# Altium schematic sheet SwitchMatrix.SchDoc
size A4
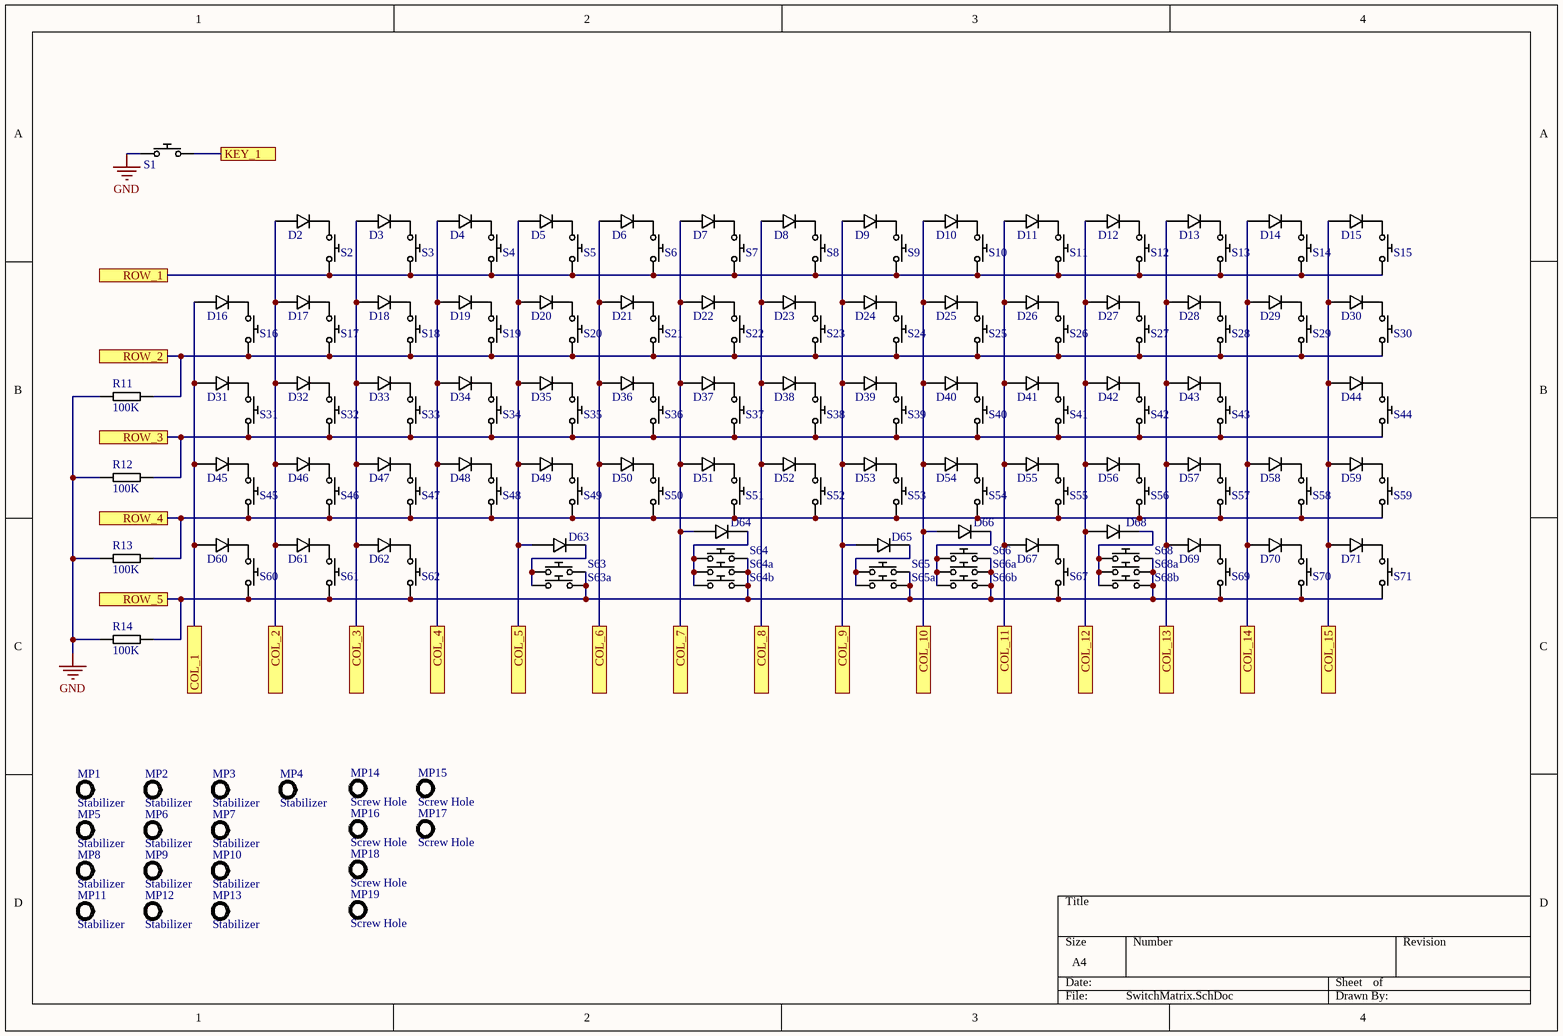
[diagram p0: SwitchMatrix.SchDoc]

## Parts
D2  Diode  [SOD_323]  (value not drawn)
D3  Diode  [SOD_323]  (value not drawn)
D4  Diode  [SOD_323]  (value not drawn)
D5  Diode  [SOD_323]  (value not drawn)
D6  Diode  [SOD_323]  (value not drawn)
D7  Diode  [SOD_323]  (value not drawn)
D8  Diode  [SOD_323]  (value not drawn)
D9  Diode  [SOD_323]  (value not drawn)
D10  Diode  [SOD_323]  (value not drawn)
D11  Diode  [SOD_323]  (value not drawn)
D12  Diode  [SOD_323]  (value not drawn)
D13  Diode  [SOD_323]  (value not drawn)
D14  Diode  [SOD_323]  (value not drawn)
D15  Diode  [SOD_323]  (value not drawn)
D16  Diode  [SOD_323]  (value not drawn)
D17  Diode  [SOD_323]  (value not drawn)
D18  Diode  [SOD_323]  (value not drawn)
D19  Diode  [SOD_323]  (value not drawn)
D20  Diode  [SOD_323]  (value not drawn)
D21  Diode  [SOD_323]  (value not drawn)
D22  Diode  [SOD_323]  (value not drawn)
D23  Diode  [SOD_323]  (value not drawn)
D24  Diode  [SOD_323]  (value not drawn)
D25  Diode  [SOD_323]  (value not drawn)
D26  Diode  [SOD_323]  (value not drawn)
D27  Diode  [SOD_323]  (value not drawn)
D28  Diode  [SOD_323]  (value not drawn)
D29  Diode  [SOD_323]  (value not drawn)
D30  Diode  [SOD_323]  (value not drawn)
D31  Diode  [SOD_323]  (value not drawn)
D32  Diode  [SOD_323]  (value not drawn)
D33  Diode  [SOD_323]  (value not drawn)
D34  Diode  [SOD_323]  (value not drawn)
D35  Diode  [SOD_323]  (value not drawn)
D36  Diode  [SOD_323]  (value not drawn)
D37  Diode  [SOD_323]  (value not drawn)
D38  Diode  [SOD_323]  (value not drawn)
D39  Diode  [SOD_323]  (value not drawn)
D40  Diode  [SOD_323]  (value not drawn)
D41  Diode  [SOD_323]  (value not drawn)
D42  Diode  [SOD_323]  (value not drawn)
D43  Diode  [SOD_323]  (value not drawn)
D44  Diode  [SOD_323]  (value not drawn)
D45  Diode  [SOD_323]  (value not drawn)
D46  Diode  [SOD_323]  (value not drawn)
D47  Diode  [SOD_323]  (value not drawn)
D48  Diode  [SOD_323]  (value not drawn)
D49  Diode  [SOD_323]  (value not drawn)
D50  Diode  [SOD_323]  (value not drawn)
D51  Diode  [SOD_323]  (value not drawn)
D52  Diode  [SOD_323]  (value not drawn)
D53  Diode  [SOD_323]  (value not drawn)
D54  Diode  [SOD_323]  (value not drawn)
D55  Diode  [SOD_323]  (value not drawn)
D56  Diode  [SOD_323]  (value not drawn)
D57  Diode  [SOD_323]  (value not drawn)
D58  Diode  [SOD_323]  (value not drawn)
D59  Diode  [SOD_323]  (value not drawn)
D60  Diode  [SOD_323]  (value not drawn)
D61  Diode  [SOD_323]  (value not drawn)
D62  Diode  [SOD_323]  (value not drawn)
D63  Diode  [SOD_323]  (value not drawn)
D64  Diode  [SOD_323]  (value not drawn)
D65  Diode  [SOD_323]  (value not drawn)
D66  Diode  [SOD_323]  (value not drawn)
D67  Diode  [SOD_323]  (value not drawn)
D68  Diode  [SOD_323]  (value not drawn)
D69  Diode  [SOD_323]  (value not drawn)
D70  Diode  [SOD_323]  (value not drawn)
D71  Diode  [SOD_323]  (value not drawn)
MP1  Stabilizer  [Cherry_stabilizer]
MP2  Stabilizer  [Cherry_stabilizer]
MP3  Stabilizer  [Cherry_stabilizer]
MP4  Stabilizer  [Cherry_stabilizer]
MP5  Stabilizer  [Cherry_stabilizer]
MP6  Stabilizer  [Cherry_stabilizer]
MP7  Stabilizer  [Cherry_stabilizer]
MP8  Stabilizer  [Cherry_stabilizer]
MP9  Stabilizer  [Cherry_stabilizer]
MP10  Stabilizer  [Cherry_stabilizer]
MP11  Stabilizer  [Cherry_stabilizer]
MP12  Stabilizer  [Cherry_stabilizer]
MP13  Stabilizer  [Cherry_stabilizer]
MP14  Screw Hole  [Slot_2.2x5mm]
MP15  Screw Hole  [Slot_2.2x5mm]
MP16  Screw Hole  [Slot_2.2x5mm]
MP17  Screw Hole  [Slot_2.2x5mm]
MP18  Screw Hole  [Slot_2.2x5mm]
MP19  Screw Hole  [Slot_2.2x5mm]
R11  100K  [Resistor_0603]
R12  100K  [Resistor_0603]
R13  100K  [Resistor_0603]
R14  100K  [Resistor_0603]
S1  Pushbutton_2P  [CherryMX_PCB_RGB]  (value not drawn)
S2  Pushbutton_2P  [CherryMX_PCB_RGB]  (value not drawn)
S3  Pushbutton_2P  [CherryMX_PCB_RGB]  (value not drawn)
S4  Pushbutton_2P  [CherryMX_PCB_RGB]  (value not drawn)
S5  Pushbutton_2P  [CherryMX_PCB_RGB]  (value not drawn)
S6  Pushbutton_2P  [CherryMX_PCB_RGB]  (value not drawn)
S7  Pushbutton_2P  [CherryMX_PCB_RGB]  (value not drawn)
S8  Pushbutton_2P  [CherryMX_PCB_RGB]  (value not drawn)
S9  Pushbutton_2P  [CherryMX_PCB_RGB]  (value not drawn)
S10  Pushbutton_2P  [CherryMX_PCB_RGB]  (value not drawn)
S11  Pushbutton_2P  [CherryMX_PCB_RGB]  (value not drawn)
S12  Pushbutton_2P  [CherryMX_PCB_RGB]  (value not drawn)
S13  Pushbutton_2P  [CherryMX_PCB_RGB]  (value not drawn)
S14  Pushbutton_2P  [CherryMX_PCB_RGB]  (value not drawn)
S15  Pushbutton_2P  [CherryMX_PCB_RGB]  (value not drawn)
S16  Pushbutton_2P  [CherryMX_PCB_RGB]  (value not drawn)
S17  Pushbutton_2P  [CherryMX_PCB_RGB]  (value not drawn)
S18  Pushbutton_2P  [CherryMX_PCB_RGB]  (value not drawn)
S19  Pushbutton_2P  [CherryMX_PCB_RGB]  (value not drawn)
S20  Pushbutton_2P  [CherryMX_PCB_RGB]  (value not drawn)
S21  Pushbutton_2P  [CherryMX_PCB_RGB]  (value not drawn)
S22  Pushbutton_2P  [CherryMX_PCB_RGB]  (value not drawn)
S23  Pushbutton_2P  [CherryMX_PCB_RGB]  (value not drawn)
S24  Pushbutton_2P  [CherryMX_PCB_RGB]  (value not drawn)
S25  Pushbutton_2P  [CherryMX_PCB_RGB]  (value not drawn)
S26  Pushbutton_2P  [CherryMX_PCB_RGB]  (value not drawn)
S27  Pushbutton_2P  [CherryMX_PCB_RGB]  (value not drawn)
S28  Pushbutton_2P  [CherryMX_PCB_RGB]  (value not drawn)
S29  Pushbutton_2P  [CherryMX_PCB_RGB]  (value not drawn)
S30  Pushbutton_2P  [CherryMX_PCB_RGB]  (value not drawn)
S31  Pushbutton_2P  [CherryMX_PCB_RGB]  (value not drawn)
S32  Pushbutton_2P  [CherryMX_PCB_RGB]  (value not drawn)
S33  Pushbutton_2P  [CherryMX_PCB_RGB]  (value not drawn)
S34  Pushbutton_2P  [CherryMX_PCB_RGB]  (value not drawn)
S35  Pushbutton_2P  [CherryMX_PCB_RGB]  (value not drawn)
S36  Pushbutton_2P  [CherryMX_PCB_RGB]  (value not drawn)
S37  Pushbutton_2P  [CherryMX_PCB_RGB]  (value not drawn)
S38  Pushbutton_2P  [CherryMX_PCB_RGB]  (value not drawn)
S39  Pushbutton_2P  [CherryMX_PCB_RGB]  (value not drawn)
S40  Pushbutton_2P  [CherryMX_PCB_RGB]  (value not drawn)
S41  Pushbutton_2P  [CherryMX_PCB_RGB]  (value not drawn)
S42  Pushbutton_2P  [CherryMX_PCB_RGB]  (value not drawn)
S43  Pushbutton_2P  [CherryMX_PCB_RGB]  (value not drawn)
S44  Pushbutton_2P  [CherryMX_PCB_RGB]  (value not drawn)
S45  Pushbutton_2P  [CherryMX_PCB_RGB]  (value not drawn)
S46  Pushbutton_2P  [CherryMX_PCB_RGB]  (value not drawn)
S47  Pushbutton_2P  [CherryMX_PCB_RGB]  (value not drawn)
S48  Pushbutton_2P  [CherryMX_PCB_RGB]  (value not drawn)
S49  Pushbutton_2P  [CherryMX_PCB_RGB]  (value not drawn)
S50  Pushbutton_2P  [CherryMX_PCB_RGB]  (value not drawn)
S51  Pushbutton_2P  [CherryMX_PCB_RGB]  (value not drawn)
S52  Pushbutton_2P  [CherryMX_PCB_RGB]  (value not drawn)
S53  Pushbutton_2P  [CherryMX_PCB_RGB]  (value not drawn)
S54  Pushbutton_2P  [CherryMX_PCB_RGB]  (value not drawn)
S55  Pushbutton_2P  [CherryMX_PCB_RGB]  (value not drawn)
S56  Pushbutton_2P  [CherryMX_PCB_RGB]  (value not drawn)
S57  Pushbutton_2P  [CherryMX_PCB_RGB]  (value not drawn)
S58  Pushbutton_2P  [CherryMX_PCB_RGB]  (value not drawn)
S59  Pushbutton_2P  [CherryMX_PCB_RGB]  (value not drawn)
S60  Pushbutton_2P  [CherryMX_PCB_RGB]  (value not drawn)
S61  Pushbutton_2P  [CherryMX_PCB_RGB]  (value not drawn)
S62  Pushbutton_2P  [CherryMX_PCB_RGB]  (value not drawn)
S63  Pushbutton_2P  [CherryMX_PCB_RGB]  (value not drawn)
S63a  Pushbutton_2P  [CherryMX_PCB_RGB]  (value not drawn)
S64  Pushbutton_2P  [CherryMX_PCB_RGB]  (value not drawn)
S64a  Comment  [CherryMX_PCB_RGB]  (value not drawn)
S64b  Comment  [CherryMX_PCB_RGB]  (value not drawn)
S65  Pushbutton_2P  [CherryMX_PCB_RGB]  (value not drawn)
S65a  Comment  [CherryMX_PCB_RGB]  (value not drawn)
S66  Pushbutton_2P  [CherryMX_PCB_RGB]  (value not drawn)
S66a  Comment  [CherryMX_PCB_RGB]  (value not drawn)
S66b  Comment  [CherryMX_PCB_RGB]  (value not drawn)
S67  Comment  [CherryMX_PCB_RGB]  (value not drawn)
S68  Pushbutton_2P  [CherryMX_PCB_RGB]  (value not drawn)
S68a  Comment  [CherryMX_PCB_RGB]  (value not drawn)
S68b  Comment  [CherryMX_PCB_RGB]  (value not drawn)
S69  Pushbutton_2P  [CherryMX_PCB_RGB]  (value not drawn)
S70  Pushbutton_2P  [CherryMX_PCB_RGB]  (value not drawn)
S71  Pushbutton_2P  [CherryMX_PCB_RGB]  (value not drawn)

## Ports
COL_1, COL_2, COL_3, COL_4, COL_5, COL_6, COL_7, COL_8, COL_9, COL_10, COL_11, COL_12, COL_13, COL_14, COL_15, KEY_1, ROW_1, ROW_2, ROW_3, ROW_4, ROW_5

## Nets
GND: R11.1 R12.1 R13.1 R14.1 S1.1
COL_1: D16.A D31.A D45.A D60.A ; port COL_1
COL_2: D2.A D17.A D32.A D46.A D61.A ; port COL_2
COL_3: D3.A D18.A D33.A D47.A D62.A ; port COL_3
COL_4: D4.A D19.A D34.A D48.A ; port COL_4
COL_5: D5.A D20.A D35.A D49.A D63.A ; port COL_5
COL_6: D6.A D21.A D36.A D50.A ; port COL_6
COL_7: D7.A D22.A D37.A D51.A D64.A ; port COL_7
COL_8: D8.A D23.A D38.A D52.A ; port COL_8
COL_9: D9.A D24.A D39.A D53.A D65.A ; port COL_9
COL_10: D10.A D25.A D40.A D54.A D66.A ; port COL_10
COL_11: D11.A D26.A D41.A D55.A D67.A ; port COL_11
COL_12: D12.A D27.A D42.A D56.A D68.A ; port COL_12
COL_13: D13.A D28.A D43.A D57.A D69.A ; port COL_13
COL_14: D14.A D29.A D58.A D70.A ; port COL_14
COL_15: D15.A D30.A D44.A D59.A D71.A ; port COL_15
KEY_1: S1.2 ; port KEY_1
ROW_1: S2.2 S3.2 S4.2 S5.2 S6.2 S7.2 S8.2 S9.2 S10.2 S11.2 S12.2 S13.2 S14.2 S15.2 ; port ROW_1
ROW_2: R11.2 S16.2 S17.2 S18.2 S19.2 S20.2 S21.2 S22.2 S23.2 S24.2 S25.2 S26.2 S27.2 S28.2 S29.2 S30.2 ; port ROW_2
ROW_3: R12.2 S31.2 S32.2 S33.2 S34.2 S35.2 S36.2 S37.2 S38.2 S39.2 S40.2 S41.2 S42.2 S43.2 S44.2 ; port ROW_3
ROW_4: R13.2 S45.2 S46.2 S47.2 S48.2 S49.2 S50.2 S51.2 S52.2 S53.2 S54.2 S55.2 S56.2 S57.2 S58.2 S59.2 ; port ROW_4
ROW_5: R14.2 S60.2 S61.2 S62.2 S63.2 S63a.2 S64.2 S64a.2 S64b.2 S65.2 S65a.2 S66.2 S66a.2 S66b.2 S67.2 S68.2 S68a.2 S68b.2 S69.2 S70.2 S71.2 ; port ROW_5
NetD2_K: D2.K S2.1
NetD3_K: D3.K S3.1
NetD4_K: D4.K S4.1
NetD5_K: D5.K S5.1
NetD6_K: D6.K S6.1
NetD7_K: D7.K S7.1
NetD8_K: D8.K S8.1
NetD9_K: D9.K S9.1
NetD10_K: D10.K S10.1
NetD11_K: D11.K S11.1
NetD12_K: D12.K S12.1
NetD13_K: D13.K S13.1
NetD14_K: D14.K S14.1
NetD15_K: D15.K S15.1
NetD16_K: D16.K S16.1
NetD17_K: D17.K S17.1
NetD18_K: D18.K S18.1
NetD19_K: D19.K S19.1
NetD20_K: D20.K S20.1
NetD21_K: D21.K S21.1
NetD22_K: D22.K S22.1
NetD23_K: D23.K S23.1
NetD24_K: D24.K S24.1
NetD25_K: D25.K S25.1
NetD26_K: D26.K S26.1
NetD27_K: D27.K S27.1
NetD28_K: D28.K S28.1
NetD29_K: D29.K S29.1
NetD30_K: D30.K S30.1
NetD31_K: D31.K S31.1
NetD32_K: D32.K S32.1
NetD33_K: D33.K S33.1
NetD34_K: D34.K S34.1
NetD35_K: D35.K S35.1
NetD36_K: D36.K S36.1
NetD37_K: D37.K S37.1
NetD38_K: D38.K S38.1
NetD39_K: D39.K S39.1
NetD40_K: D40.K S40.1
NetD41_K: D41.K S41.1
NetD42_K: D42.K S42.1
NetD43_K: D43.K S43.1
NetD44_K: D44.K S44.1
NetD45_K: D45.K S45.1
NetD46_K: D46.K S46.1
NetD47_K: D47.K S47.1
NetD48_K: D48.K S48.1
NetD49_K: D49.K S49.1
NetD50_K: D50.K S50.1
NetD51_K: D51.K S51.1
NetD52_K: D52.K S52.1
NetD53_K: D53.K S53.1
NetD54_K: D54.K S54.1
NetD55_K: D55.K S55.1
NetD56_K: D56.K S56.1
NetD57_K: D57.K S57.1
NetD58_K: D58.K S58.1
NetD59_K: D59.K S59.1
NetD60_K: D60.K S60.1
NetD61_K: D61.K S61.1
NetD62_K: D62.K S62.1
NetD63_K: D63.K S63.1 S63a.1
NetD64_K: D64.K S64.1 S64a.1 S64b.1
NetD65_K: D65.K S65.1 S65a.1
NetD66_K: D66.K S66.1 S66a.1 S66b.1
NetD67_K: D67.K S67.1
NetD68_K: D68.K S68.1 S68a.1 S68b.1
NetD69_K: D69.K S69.1
NetD70_K: D70.K S70.1
NetD71_K: D71.K S71.1

## Library data of the parts
MP1-MP13 = Cherry_Stabilizer
MP14-MP19 = Mechanical_part
R11-R14 = Resistor
S64a S64b S65a S66a S66b S67 S68a S68b = Pushbutton_2P